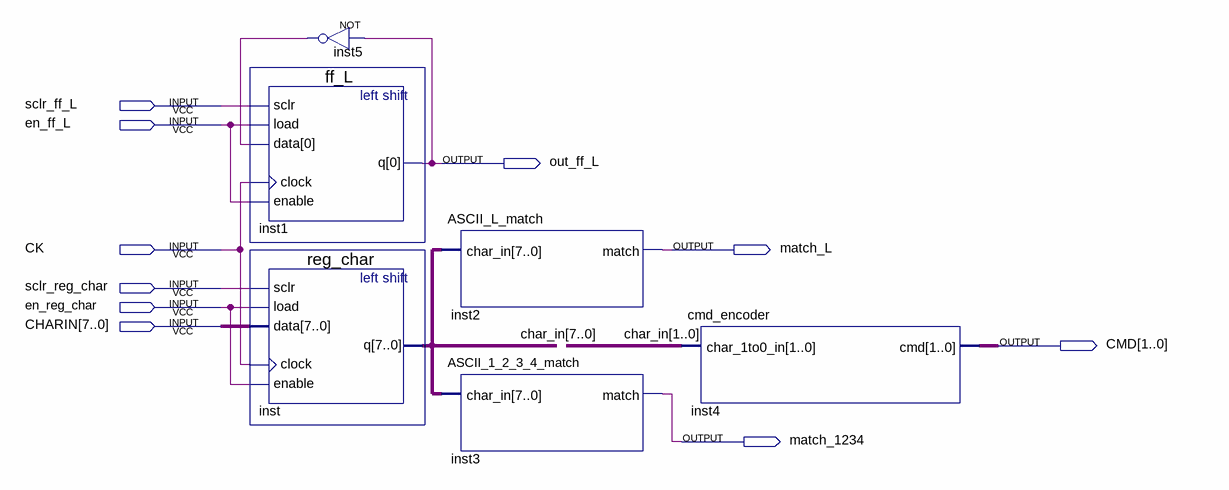
[diagram p0: schematic sheet]
// Quartus schematic parser_DP.bdf as structural Verilog: 6 symbols, 10 pins
module parser_DP (
  input  sclr_ff_L,
  input  en_ff_L,
  input  CK,
  input  sclr_reg_char,
  input  en_reg_char,
  input  [7:0] CHARIN,
  output out_ff_L,
  output match_L,
  output [1:0] CMD,
  output match_1234
);

  wire inst5_out;
  wire [7:0] char_in;

  not inst5 (inst5_out, out_ff_L);
  ff_L inst1 (.sclr(sclr_ff_L), .load(en_ff_L), .data(inst5_out), .clock(CK), .enable(en_ff_L), .q(out_ff_L));
  reg_char inst (
    .sclr(sclr_reg_char), .load(en_reg_char), .data(CHARIN), .clock(CK), .enable(en_reg_char), .q(char_in));
  ASCII_L_match inst2 (.char_in(char_in), .match(match_L));
  ASCII_1_2_3_4_match inst3 (.char_in(char_in), .match(match_1234));
  cmd_encoder inst4 (.char_1to0_in(char_in[1:0]), .cmd(CMD));
endmodule
